# Altium schematic sheet Studio Light Panel.SchDoc: Studio Light Panel
size A4; SheetNumber: 1; SheetTotal: 4
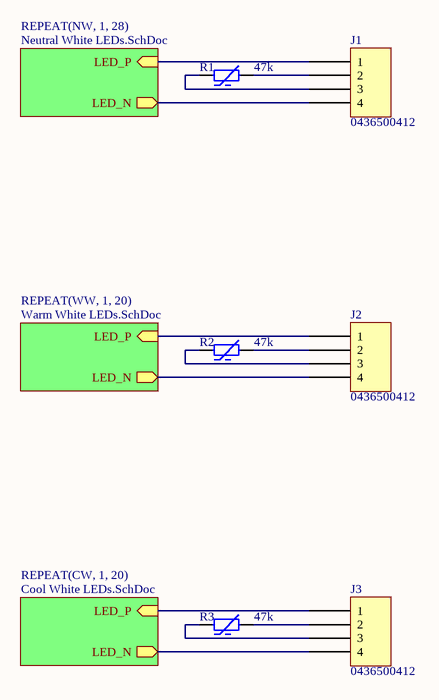
[diagram p0: Studio Light Panel.SchDoc]

## Parts
J1  0436500412  [MOLEX 436500412]
J2  0436500412  [MOLEX 436500412]
J3  0436500412  [MOLEX 436500412]
R1  47k  [NTC 0402_1005]
R2  47k  [NTC 0402_1005]
R3  47k  [NTC 0402_1005]

## Sub-sheets
REPEAT(CW, 1, 20) = Cool White LEDs.SchDoc: LED_P (in), LED_N (out)
REPEAT(NW, 1, 28) = Neutral White LEDs.SchDoc: LED_P (in), LED_N (out)
REPEAT(WW, 1, 20) = Warm White LEDs.SchDoc: LED_P (in), LED_N (out)

## Nets
NetJ1_1: J1.1 ; sheet REPEAT(NW, 1, 28)/LED_P
NetJ1_2: J1.2 R1.2
NetJ1_3: J1.3 R1.1
NetJ1_4: J1.4 ; sheet REPEAT(NW, 1, 28)/LED_N
NetJ2_1: J2.1 ; sheet REPEAT(WW, 1, 20)/LED_P
NetJ2_2: J2.2 R2.2
NetJ2_3: J2.3 R2.1
NetJ2_4: J2.4 ; sheet REPEAT(WW, 1, 20)/LED_N
NetJ3_1: J3.1 ; sheet REPEAT(CW, 1, 20)/LED_P
NetJ3_2: J3.2 R3.2
NetJ3_3: J3.3 R3.1
NetJ3_4: J3.4 ; sheet REPEAT(CW, 1, 20)/LED_N

## Notes on the sheet
- Title
- Size:
- Date:
- A4
- Number:
- Time:
- Revision:
- Sheet
- of
- File:

## Library data of the parts
J1-J3 = 0436500412: CONN HEADER SMD R/A 4POS 3MM; Manufacturer: Molex; Material Flammability Rating: UL94 V-0; Number of Positions: 4; Number of Positions Loaded: All; Pitch - Mating: 0.118" (3.00mm); Shrouding: Shrouded - 4 Wall; Style: Board to Cable/Wire; Part Number: 0436500412; ComponentLink1Description: Datasheet; ComponentLink1URL: https://www.molex.com/pdm_docs/sd/436500412_sd.pdf; ComponentLink2Description: DigiKey Link; ComponentLink2URL: https://www.digikey.com/en/products/detail/molex/0436500412/3451041; Connector Type: Header; Contact Finish - Mating: Tin; Contact Finish - Post: Tin; Contact Finish Thickness - Mating: 60.0µin (1.52µm); Contact Material: Brass; Contact Shape: Square; Contact Type: Male Pin; Fastening Type: Locking Ramp; Features: Solder Retention; Insulation Color: Black; Insulation Height: 0.172" (4.37mm); Insulation Material: Liquid Crystal Polymer (LCP), Glass Filled; LastUpdated: 21/03/2022 20:35:03; Lifecycle Status: Active; Minimum Order: 1; Mounting Type: Surface Mount, Right Angle; Number of Rows: 1; Packaging: TapeAndReel; PartId: 134; Part Status: Active; Price: 1.64; Series: Micro-Fit 3.0 43650; Supplier 1: DigiKey; Supplier Part Number 1: WM1892CT-ND; Termination: Solder
R1-R3 = NTCG104BF473FT1X: THERMISTOR NTC 47KOHM 4485K 0402; Manufacturer: TDK Corporation; B25/85: 4550K; B Value Tolerance: ±1%; Power - Max: 100 mW; Part Number: NTCG104BF473FT1X; B25/50: 4485K; ComponentLink1Description: Datasheet; ComponentLink1URL: https://product.tdk.com/info/en/catalog/datasheets/503021/tpd_commercial_ntc-thermistor_ntcg_en.pdf?ref_disty=digikey; ComponentLink2Description: DigiKey Link; ComponentLink2URL: https://www.digikey.com/en/products/detail/tdk-corporation/NTCG104BF473FT1X/5285693; Device Package: 0402 (1005 Metric); LastUpdated: 21/03/2022 19:01:14; Lifecycle Status: Active; Minimum Order: 1; Mounting Type: Surface Mount; Operating Temperature: -40°C ~ 125°C; Package / Case: 0402 (1005 Metric); Packaging: TapeAndReel; PartId: 53; Part Status: Active; Price: 0.03; Resistance in Ohms @ 25°C: 47k; Resistance Tolerance: ±1%; Series: NTCG; Supplier 1: DigiKey; Supplier Part Number 1: 445-174900-1-ND; Value: 47k